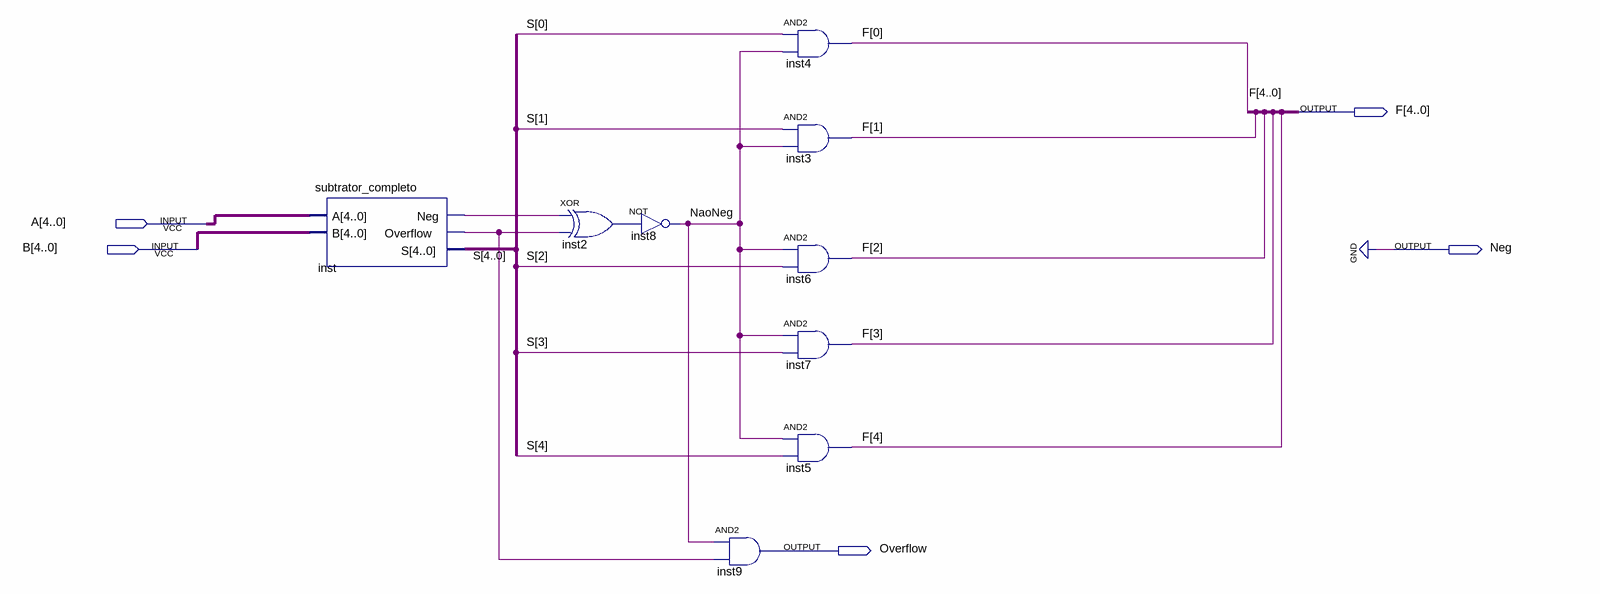
[diagram p0: schematic sheet]
// Quartus schematic max_zero_ab.bdf as structural Verilog: 9 symbols, 5 pins
module max_zero_ab (
  input  [4:0] A,
  input  [4:0] B,
  output [4:0] F,
  output Neg,
  output Overflow
);

  wire inst2_out, inst_neg, inst_overflow, NaoNeg;
  wire [4:0] S;

  subtrator_completo inst (.A(A), .B(B), .Neg(inst_neg), .Overflow(inst_overflow), .S(S));
  xor inst2 (inst2_out, inst_neg, inst_overflow);
  not inst8 (NaoNeg, inst2_out);
  and inst9 (Overflow, NaoNeg, inst_overflow);
  and inst4 (F[0], S[0], NaoNeg);
  and inst3 (F[1], S[1], NaoNeg);
  and inst6 (F[2], NaoNeg, S[2]);
  and inst7 (F[3], NaoNeg, S[3]);
  and inst5 (F[4], NaoNeg, S[4]);

  assign Neg = 1'b0;
endmodule
